# EAGLE design InhalerCap_v1 (EAGLE 7.2.0)
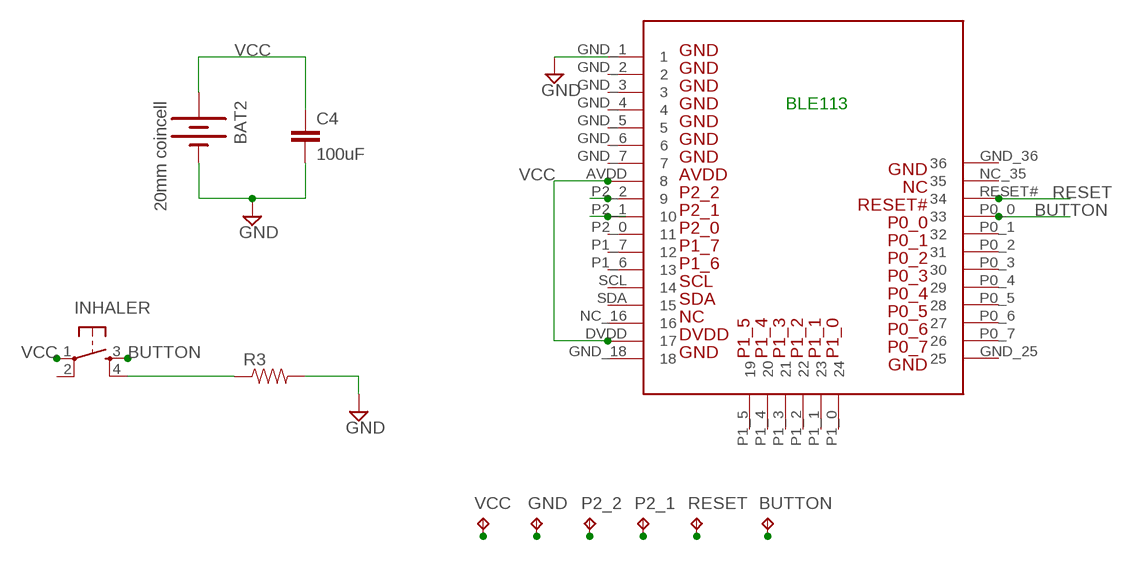
[diagram p0: schematic, sheet 1]

## Parts
BAT2  20mm coincell  BATTERY20MM_4LEGS  [BATTCON_20MM_4LEGS]
BUTTON  TPTP20SQ  [TP20SQ]
C4  100uF  CAP1206  [1206]
GND  TPTP20SQ  [TP20SQ]
INHALER  TAC_SWITCHSMD  [TACTILE_SWITCH_SMD]
P2_1  TPTP20SQ  [TP20SQ]
P2_2  TPTP20SQ  [TP20SQ]
R3  RESISTOR0603-RES  [0603-RES]
RESET  TPTP20SQ  [TP20SQ]
U$1  BLE113-A  [BLE113-A]
VCC  TPTP20SQ  [TP20SQ]

## Nets
1: INHALER.4 R3.1
BUTTON: BUTTON.TP INHALER.3 U$1.P0_0
GND: BAT2.2(-) C4.2 GND.TP R3.2 U$1.GND_1
P2_1: P2_1.TP U$1.P2_1
P2_2: P2_2.TP U$1.P2_2
RESET: RESET.TP U$1.RESET#
VCC: BAT2.1(+) C4.1 INHALER.1 U$1.AVDD U$1.DVDD VCC.TP
Unconnected: INHALER.2 U$1.GND_2 U$1.GND_3 U$1.GND_4 U$1.GND_5 U$1.GND_6 U$1.GND_7 U$1.GND_18 U$1.GND_25 U$1.GND_36 U$1.NC_16 U$1.NC_35 U$1.P0_1 U$1.P0_2 U$1.P0_3 U$1.P0_4 U$1.P0_5 U$1.P0_6 U$1.P0_7 U$1.P1_0 U$1.P1_1 U$1.P1_2 U$1.P1_3 U$1.P1_4 U$1.P1_5 U$1.P1_6 U$1.P1_7 U$1.P2_0 U$1.SCL U$1.SDA

## Notes on the sheet
- BLE113

## Library data of the parts
BAT2 = SparkFun-Electromechanical:BATTERY: Battery Holders Various common sizes : AA, AAA, 20mm coin cell and 12mm coin cell. 20MM_4LEGS, BATT-10373; PROD_ID: BATT-10373
BUTTON GND P2_1 P2_2 RESET VCC = testpad:TP: Test pad
C4 = SparkFun-Capacitors:CAP: Capacitor Standard 0603 ceramic capacitor, and 0.1" leaded capacitor.
INHALER = SparkFun-Electromechanical:TAC_SWITCH: Momentary Switch Button commonly used for reset or general input. Spark Fun Electronics SKU : COM-00097 SMT- SWCH-08247; PROD_ID: SWCH-08247
R3 = SparkFun-Passives:RESISTOR: Resistor Basic schematic elements and footprints for 0603, 1206, and PTH resistors.
U$1 = BLE113-A:BLE113-A

## Board
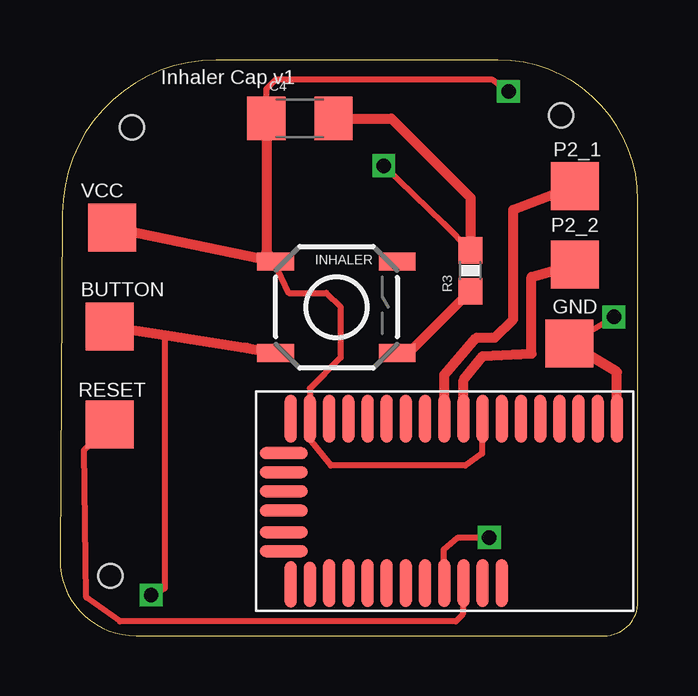
[diagram p1: board, top side]
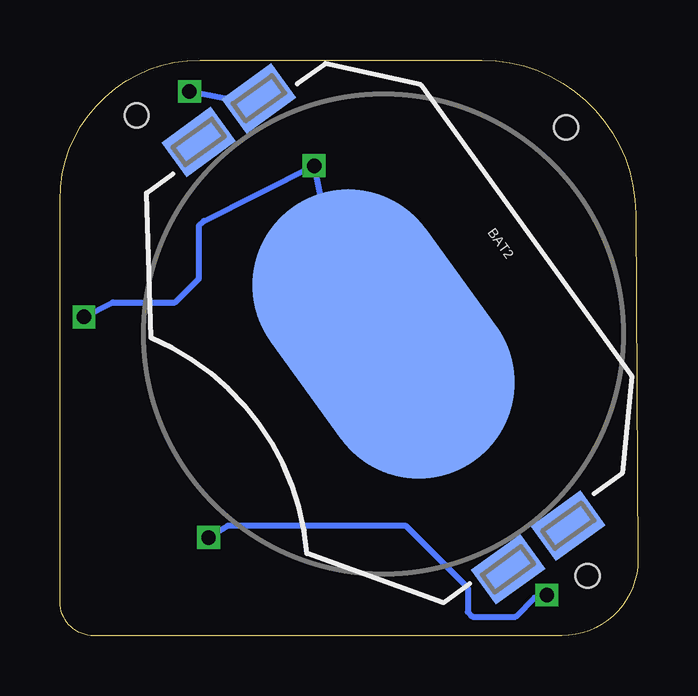
[diagram p2: board, bottom side, seen from below]

Size 24.1 x 24.01 mm. Coordinates in mm from the lower left corner, seen from the top.
Outline: 24.1,1.41 24.1,18.18 arc90 18.26,24.01 6.51,24.01 arc90 0.1,17.6 0,3.18 arc90 3.18,0 22.69,0 arc90 24.1,1.41
Copper layers (1*16): Top 0.0356mm / dielectric 1.5011mm / Bottom 0.0356mm
Design rules "OSH": minimum track width 6mil, minimum drill 13mil, track to track 6mil, track to pad 6mil, pad to pad 6mil, via to via 6mil, smd to smd 6mil, copper to edge 15mil, drill to drill 6mil, minimum pad ring 7mil, minimum via ring 7mil, stop-mask expansion 3mil, vias tented up to drill 0mil, thermal gap 10mil
Holes 1 mm at 20.9,21.7 3,21.2 2.1,2.5

### Footprints (pad centres in the part's own frame; a part is rotated, then mirrored left to right if it is on the bottom)
BATTCON_20MM_4LEGS = smd 1.778 x 2.54: 1 -11,1.55; 3 11,1.55; P$1 -11,-1.55; P$2 11,-1.55 | smd 13 x 8: 2 0,0
TP20SQ = smd 2 x 2: TP 0,0
1206 = smd 1.6 x 1.8: 1 -1.4,0; 2 1.4,0
TACTILE_SWITCH_SMD = smd 1.524 x 0.762: 1 -2.54,1.905; 2 2.54,1.905; 3 -2.54,-1.905; 4 2.54,-1.905
0603-RES = smd 1.1 x 1: 1 -0.85,0; 2 0.85,0
BLE113-A = smd 2 x 0.5: AVDD 1.15,9.45; DVDD 1.15,2.25; GND_1 1.15,15.05; GND_2 1.15,14.25; GND_3 1.15,13.45; GND_4 1.15,12.65; GND_5 1.15,11.85; GND_6 1.15,11.05; GND_7 1.15,10.25; GND_18 1.15,1.45; GND_36 8,10.25; NC_16 1.15,3.05; NC_35 8,9.45; P0_0 8,7.85; P0_1 8,7.05; P0_2 8,6.25; P0_3 8,5.45; P0_4 8,4.65; P0_5 8,3.85; P0_6 8,3.05; P1_6 1.15,5.45; P1_7 1.15,6.25; P2_0 1.15,7.05; P2_1 1.15,7.85; P2_2 1.15,8.65; RESET# 8,8.65; SCL 1.15,4.65; SDA 1.15,3.85 | smd 1.95 x 0.5: GND_25 8.05,1.45 | smd 1.9 x 0.5: P0_7 8.05,2.25 | smd 0.5 x 2: P1_0 6.675,1.15; P1_1 5.875,1.15; P1_2 4.975,1.15; P1_3 4.175,1.15; P1_4 3.375,1.15; P1_5 2.575,1.15

### Placement (x,y rotation side)
BAT2  10.61,12.59 305.9 bottom
BUTTON  2.07,12.9 0 top
C4  10.01,21.57 0 top
GND  21.24,12.18 0 top
INHALER  11.53,13.7 0 top
P2_1  21.47,18.74 0 top
P2_2  21.47,15.49 0 top
R3  17.12,15.22 90 top
RESET  2.07,8.81 0 top
U$1  8.17,10.2 270 top
VCC  2.17,17.02 0 top

### Tracks (layer width: path | path; a pad name or v marks a point on that pad's centre or on a via)
1
  Top 0.406: INHALER.4 14.54,11.79 R3.1
BUTTON  (via drill 0.6)
  Top 0.254: U$1.P0_0 16,2.17 | 16,2.17 16,2.1 | 16,2.17 16,3.6 16.6,4.1 v17.9,4.1 | v3.8,1.7 4.38,1.98 4.38,12.54
  Top 0.406: BUTTON.TP 4.38,12.54 7.8,12 INHALER.3
  Bottom 0.254: v17.9,4.1 17.1,4.6 9.7,4.6 7.1,2 7.1,1 6.9,0.8 5.1,0.8 4.3,1.6 v3.8,1.7
GND  (via drill 0.6)
  Top 0.254: R3.2 16,17.19 v13.5,19.6 | GND.TP 21.75,12.5 v23.1,13.3
  Top 0.406: C4.2 13.82,21.57 17.12,18.27 R3.2 | U$1.GND_1 23.22,11 GND.TP
  Bottom 0.254: 11.2,12.71 11.2,13.2 11.6,13.6 12.3,13.6 v13.5,19.6 18.1,17.3 18.3,17.1 18.3,14.9 19.3,13.9 21.9,13.9 v23.1,13.3
  Bottom 0.406: BAT2.2 11.2,12.71 13.56,13.19
P2_1
  Top 0.406: U$1.P2_1 16.02,10.88 17.37,12.43 18.13,12.43 18.9,13.19 18.9,17.76 P2_1.TP
P2_2
  Top 0.406: U$1.P2_2 16.82,10.67 17.63,11.67 19.66,11.77 19.66,14.97 P2_2.TP
RESET
  Top 0.254: 16.8,2 16.8,0.9 16.5,0.6 2.5,0.6 1.1,1.6 1,7.74 RESET.TP
  Top 0.305: U$1.RESET# 16.8,2
VCC  (via drill 0.6)
  Top 0.254: 8.91,15.62 9.53,14.3 11.1,14.3 11.7,13.7 11.7,11.6 10.42,10.32 U$1.DVDD 10.4,8.82 10.4,8.2 11.3,7.1 16.9,7.1 17.6,7.6 17.6,8.82 U$1.AVDD | C4.1 8.61,22.81 9,23.2 18,23.2 v18.7,22.7
  Top 0.406: VCC.TP 8.91,15.62 INHALER.1 8.61,15.99 C4.1
  Bottom 0.254: v18.7,22.7 17.21,22.41 BAT2.1

### Text on the board
tNames: Inhaler Cap v1